# Altium schematic sheet A1 power map.SchDoc
size A3; SheetNumber: 2; SheetTotal: 16
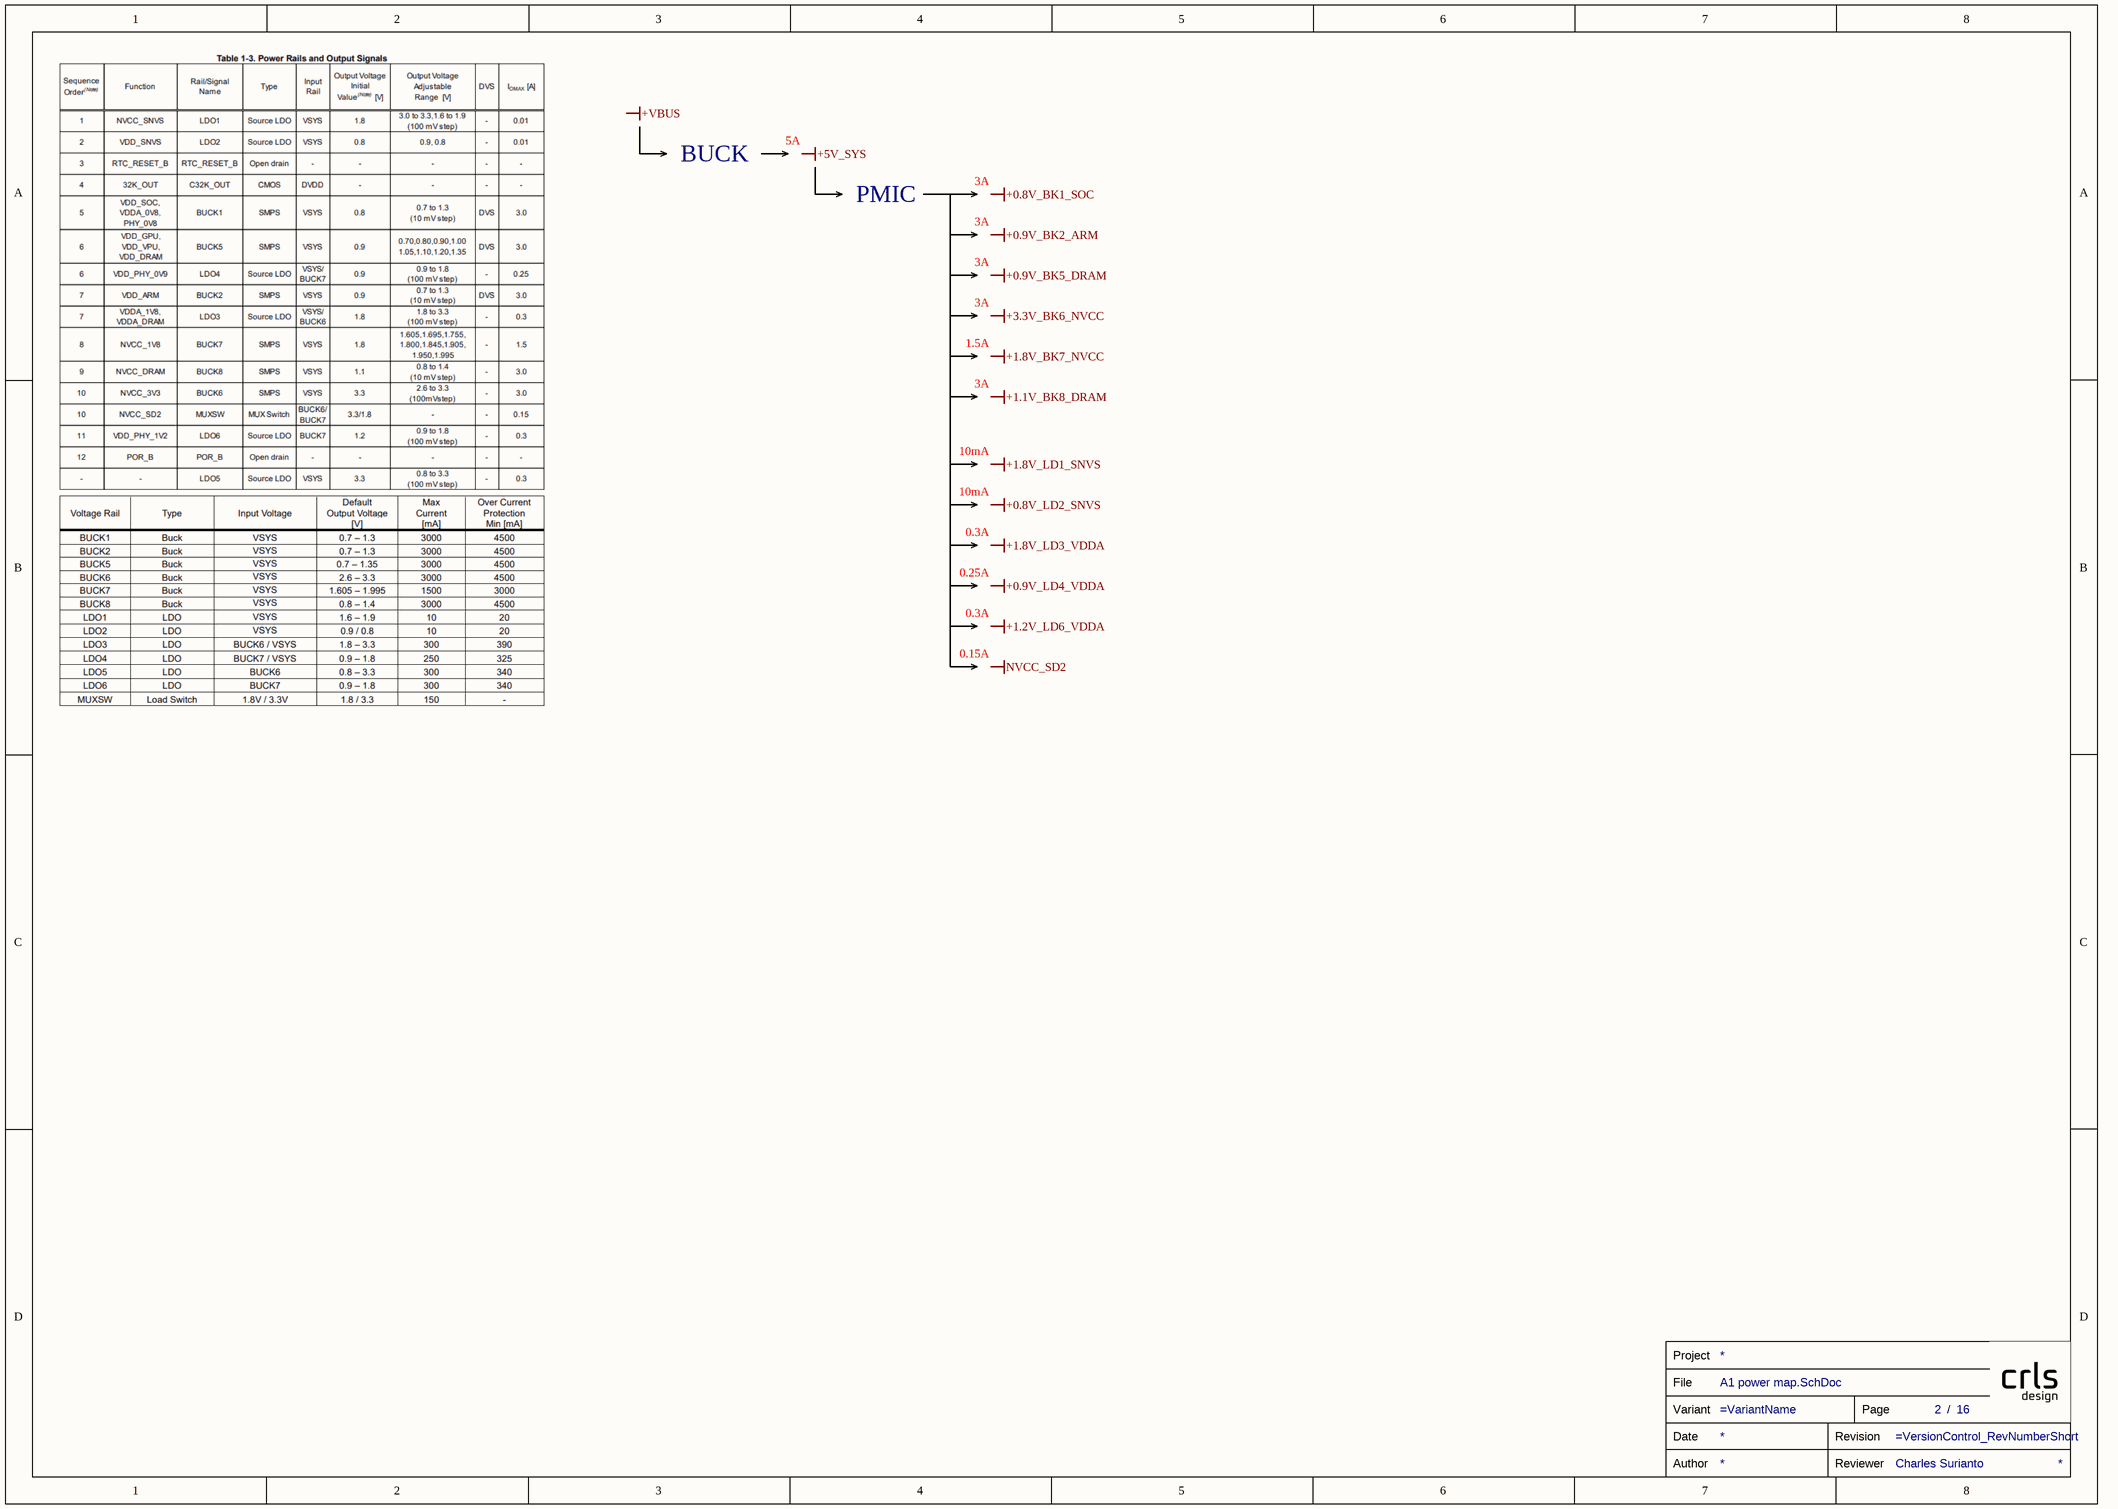
[diagram p0: A1 power map.SchDoc]

## Parts
TB?  Reviewer: Charles Surianto  (hidden comment: TITLE_BLOCK)  (graphical)

## Notes on the sheet
- BUCK
- 5A
- 3A
- PMIC
- 1.5A
- 10mA
- 0.3A
- 0.25A
- 0.15A
- Labels drawn without touching a wire or pin: +0.8V_BK1_SOC, +0.8V_LD2_SNVS, +0.9V_BK2_ARM, +0.9V_BK5_DRAM, +0.9V_LD4_VDDA, +1.1V_BK8_DRAM, +1.2V_LD6_VDDA, +1.8V_BK7_NVCC, +1.8V_LD1_SNVS, +1.8V_LD3_VDDA, +3.3V_BK6_NVCC, +5V_SYS, +VBUS, NVCC_SD2
- (in symbol TITLE_BLOCK) Project; File; Variant; Page; /; Date; Revision; Author; Reviewer

## Library data of the parts
TB? = TITLE_BLOCK: Review Date: *